# Altium schematic sheet ETHERNET_STM32.SchDoc
size A4; SheetNumber: 22; SheetTotal: 26
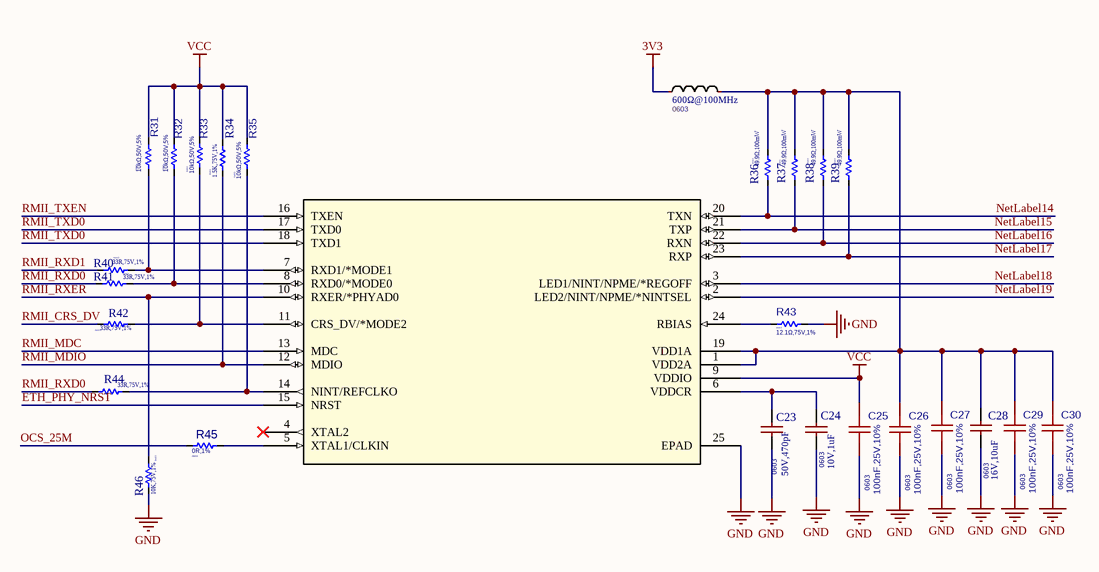
[diagram p0: ETHERNET_STM32.SchDoc]

## Parts
C23  value 50V,470pF  Package: 0603  [c-0603]  (hidden comment: 470pF)
C24  value 10V,1uF  Package: 0603  [CAPC1608X90N]  (hidden comment: 1uF)
C25  value 100nF,25V,10%  Package: 0603  [C0603]  (hidden comment: 100nF)
C26  value 100nF,25V,10%  Package: 0603  [C0603]  (hidden comment: 100nF)
C27  value 100nF,25V,10%  Package: 0603  [C0603]  (hidden comment: 100nF)
C28  value 16V,10uF  Package: 0603  [CAPC1608X90N]  (hidden comment: 10uf)
C29  value 100nF,25V,10%  Package: 0603  [C0603]  (hidden comment: 100nF)
C30  value 100nF,25V,10%  Package: 0603  [C0603]  (hidden comment: 100nF)
R31  value 10kΩ,50V,5%  Package: 0402  [R0402]  (hidden comment: 10kΩ)
R32  value 10kΩ,50V,5%  Package: 0402  [R0402]  (hidden comment: 10kΩ)
R33  value 10kΩ,50V,5%  Package: 0402  [R0402]  (hidden comment: 10kΩ)
R34  value 1.5K,75V,1%  Package: 0603  [R0603]  (hidden comment: 1.5K)
R35  value 10kΩ,50V,5%  Package: 0402  [R0402]  (hidden comment: 10kΩ)
R36  value 49.9Ω,100mW  Package: 0603  [R0603]  (hidden comment: 49.9 R)
R37  value 49.9Ω,100mW  Package: 0603  [R0603]  (hidden comment: 49.9 R)
R38  value 49.9Ω,100mW  Package: 0603  [R0603]  (hidden comment: 49.9 R)
R39  value 49.9Ω,100mW  Package: 0603  [R0603]  (hidden comment: 49.9 R)
R40  value 33R,75V,1%  Package: 0603  [R0603]  (hidden comment: 33R)
R41  value 33R,75V,1%  Package: 0603  [R0603]  (hidden comment: 33R)
R42  value 33R,75V,1%  Package: 0603  [R0603]  (hidden comment: 33R)
R43  value 12.1Ω,75V,1%  Package: 0603  [R0603]  (hidden comment: 12.1K)
R44  value 33R,75V,1%  Package: 0603  [R0603]  (hidden comment: 33R)
R45  Package: 0603  [R0603]  (hidden comment: 0R,1%)
R46  Package: 0603  [R0603]  (hidden comment: 10K,75V,1%)
U4  value 600Ω@100MHz  Package: 0603  [L-0603]  (hidden comment: BLM18AG601SN1D)
U5  LAN8742A-CZ-TR  [QFN-24-EP(4x4)]  (value not drawn)

## Nets
3V3: U4.1
GND: C23.1 C24.1 C25.1 C26.1 C27.1 C28.1 C29.1 C30.1 R43.2 R46.1 U5.25(EPAD)
VCC: C25.2 R31.2 R32.2 R33.2 R34.2 R35.2 U5.9(VDDIO)
ETH_PHY_NRST: U5.15(NRST)
NetLabel14: R36.1 U5.20(TXN)
NetLabel15: R37.1 U5.21(TXP)
NetLabel16: R38.1 U5.22(RXN)
NetLabel17: R39.1 U5.23(RXP)
NetLabel18: U5.3(LED1/NINT/NPME/*REGOFF)
NetLabel19: U5.2(LED2/NINT/NPME/*NINTSEL)
OCS_25M: R45.1
RMII_CRS_DV: R42.1
RMII_MDC: U5.13(MDC)
RMII_MDIO: R34.1 U5.12(MDIO)
RMII_RXD0: R41.1 R44.1
RMII_RXD1: R40.1
RMII_RXER: R46.2 U5.10(RXER/*PHYAD0)
RMII_TXD0: U5.17(TXD0) U5.18(TXD1)
RMII_TXEN: U5.16(TXEN)
NetC23_2: C23.2 C24.2 U5.6(VDDCR)
NetC26_2: C26.2 C27.2 C28.2 C29.2 C30.2 R36.2 R37.2 R38.2 R39.2 U4.2 U5.1(VDD2A) U5.19(VDD1A)
NetR31_1: R31.1 R40.2 U5.7(RXD1/*MODE1)
NetR32_1: R32.1 R41.2 U5.8(RXD0/*MODE0)
NetR33_1: R33.1 R42.2 U5.11(CRS_DV/*MODE2)
NetR35_1: R35.1 R44.2 U5.14(NINT/REFCLKO)
NetR43_1: R43.1 U5.24(RBIAS)
NetR45_2: R45.2 U5.5(XTAL1/CLKIN)

Not connected (* = marked no-connect by the designer): U5 4(XTAL2)*

## Library data of the parts
C23 = CL10B471KB8NNNC: 50V 470pF X7R ±10% 0603 Multilayer Ceramic Capacitors MLCC - SMD/SMT ROHS; Manufacturer: FH; Datasheet: https://datasheet.lcsc.com/lcsc/2304140030_Samsung-Electro-Mechanics-CL10B471KB8NNNC_C22396.pdf; LCSC: C22396; MPN: CL10B471KB8NNNC
C24 = CL10A105KP8NNNC: 10V 1uF X5R ±10% 0603 Multilayer Ceramic Capacitors MLCC - SMD/SMT ROHS; Manufacturer: SAMSUNG; Datasheet: https://datasheet.lcsc.com/lcsc/2304140030_Samsung-Electro-Mechanics-CL10A105KP8NNNC_C26413.pdf; LCSC: C26413; MPN: CL10A105KP8NNNC
C25-C27 C29 C30 = CL10B104KA8NNNC: 25V 100nF X7R ±10% 0603 Multilayer Ceramic Capacitors MLCC - SMD/SMT ROHS; Manufacturer: SAMSUNG; Type: *; Min Operating Temp: -55; Max Operating Temp: +125; MPN: CL10B104KA8NNNC; Datasheet: https://datasheet.lcsc.com/lcsc/2304140030_Samsung-Electro-Mechanics-CL10B104KA8NNNC_C1590.pdf; LCSC: C1590
C28 = 0603F106M160NT: 16V 10uF Y5V ±20% 0603 Multilayer Ceramic Capacitors MLCC - SMD/SMT ROHS; Manufacturer: KEMET; MPN: CC0603KRX7R9BB104; Datasheet: http://componentsearchengine.com/Datasheets/3/CC0603KRX7R9BB104.pdf; LCSC: C48906
R31-R33 R35 = RC0402JR-0710KL: 62.5mW Thick Film Resistors 50V ±100ppm/℃ ±5% 10kΩ 0402 Chip Resistor - Surface Mount ROHS; Manufacturer: YAGEO; MPN: RC0402JR-0710KL; Max Operating Temp: +155; Min Operating Temp: -55; Datasheet: https://datasheet.lcsc.com/lcsc/1810241334_YAGEO-RC0402JR-0710KL_C60489.pdf; LCSC: C60489
R34 = RC0603FR-071K5L: 100mW Thick Film Resistors 75V ±100ppm/℃ ±1% 1.5kΩ 0603 Chip Resistor - Surface Mount ROHS; Manufacturer: Yageo; MPN: RC0603FR-071K5L; Datasheet: https://www.lcsc.com/datasheet/lcsc_datasheet_2304140030_YAGEO-RC0603FR-071K5L_C114668.pdf; LCSC: C114668
R36-R39 = ERJ-3EKF49R9V: 100mW Thick Film Resistors ±100ppm/℃ ±1% 49.9Ω 0603 Chip Resistor - Surface Mount ROHS; Manufacturer: Panasonic; Datasheet: https://industrial.panasonic.com/cdbs/www-data/pdf/RDA0000/AOA0000C304.pdf; MPN: ERJ-3EKF49R9V; LCSC: C403255
R40-R42 R44 = RC0603FR-0733RL: 100mW Thick Film Resistors 75V ±100ppm/℃ ±1% 270Ω 0603 Chip Resistor - Surface Mount ROHS; Manufacturer: Yageo; MPN: RC0603FR-0733RL; Datasheet: https://datasheet.lcsc.com/lcsc/2304140030_YAGEO-RC0603FR-0733RL_C108661.pdf; LCSC: C108661
R43 = RC0603FR-0712K1L: 100mW Thick Film Resistors 75V ±100ppm/℃ ±1% 12.1kΩ 0603 Chip Resistor - Surface Mount ROHS; Manufacturer: YAGEO; Type: *; Min Operating Temp: -55; MPN: RC0603FR-0712K1L; Datasheet: https://www.yageo.com/upload/media/product/products/datasheet/rchip/PYu-RC_Group_51_RoHS_L_12.pdf; Max Operating Temp: +155; LCSC: C123417
R45 = AC0603FR-070RL: RES SMD 0 OHM JUMPER 1/10W 0603; Manufacturer: YAGEO; Type: SM; Min Operating Temp: -55°C; Max Operating Temp: 155°C; Datasheet: https://www.yageo.com/upload/media/product/productsearch/datasheet/rchip/PYu-AC_51_RoHS_L_10.pdf; MPN: AC0603FR-070RL; LCSC: C116699; Value: 0R,1%
R46 = 0603WAF1002T5E: 100mW Thick Film Resistors ±100ppm/℃ ±1% 10kΩ 0603 Chip Resistor - Surface Mount ROHS; Manufacturer: UNI-ROYAL(Uniroyal Elec); Max Operating Temp: 155℃; Min Operating Temp: -55℃; MPN: 0603WAF1002T5E; Datasheet: https://datasheet.lcsc.com/szlcsc/Uniroyal-Elec-0603WAF1002T5E_C25804.pdf; LCSC: C25804; Value: 10K,75V,1%
U4 = BLM18AG601SN1D: 380mΩ ±25% 600Ω@100MHz 0603 Ferrite Beads ROHS; Manufacturer: muRata; LCSC: C19330; MPN: BLM18AG601SN1D; Datasheet: https://www.lcsc.com/datasheet/lcsc_datasheet_2304140030_Murata-Electronics-BLM18AG601SN1D_C19330.pdf
U5 = LAN8742A-CZ-TR: QFN-24-EP(4x4) Ethernet ICs ROHS; Manufacturer: MICROCHIP(美国微芯); Value: Ethernet Transceivers; LCSC: C621424; MPN: LAN8742A-CZ-TR; Package Reference: QFN-24-EP(4x4); Datasheet: https://atta.szlcsc.com/upload/public/pdf/source/20201120/C621424_261C8C55AFDB52EE903AE3A1A642D6DC.pdf; Min Operating Temp: -40; Max Operating Temp: +85